# Altium schematic sheet Scheme.SchDoc
size A4
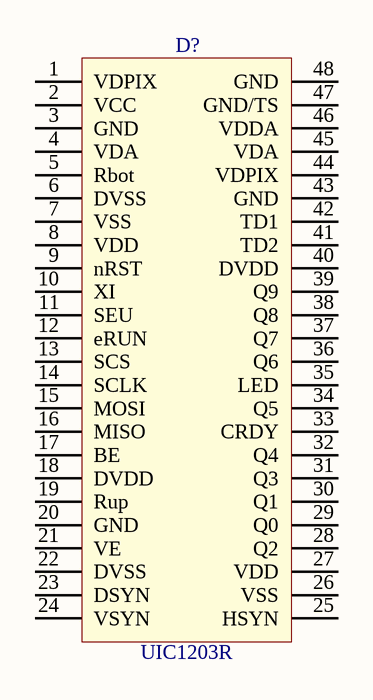
[diagram p0: Scheme.SchDoc]

## Parts
D?  UIC1203R  [UIC1203R]

## Nets

Not connected (* = marked no-connect by the designer): D? 1(VDPIX) 2(VCC) 3(GND) 4(VDA) 5(Rbot) 6(DVSS) 7(VSS) 8(VDD) 9(nRST) 10(XI) 11(SEU) 12(eRUN) 13(SCS) 14(SCLK) 15(MOSI) 16(MISO) 17(BE) 18(DVDD) 19(Rup) 20(GND) 21(VE) 22(DVSS) 23(DSYN) 24(VSYN) 25(HSYN) 26(VSS) 27(VDD) 28(Q2) 29(Q0) 30(Q1) 31(Q3) 32(Q4) 33(CRDY) 34(Q5) 35(LED) 36(Q6) 37(Q7) 38(Q8) 39(Q9) 40(DVDD) 41(TD2) 42(TD1) 43(GND) 44(VDPIX) 45(VDA) 46(VDDA) 47(GND/TS) 48(GND)